# Altium schematic sheet Sheet1.SchDoc
size A2; SheetNumber: 1; SheetTotal: 1
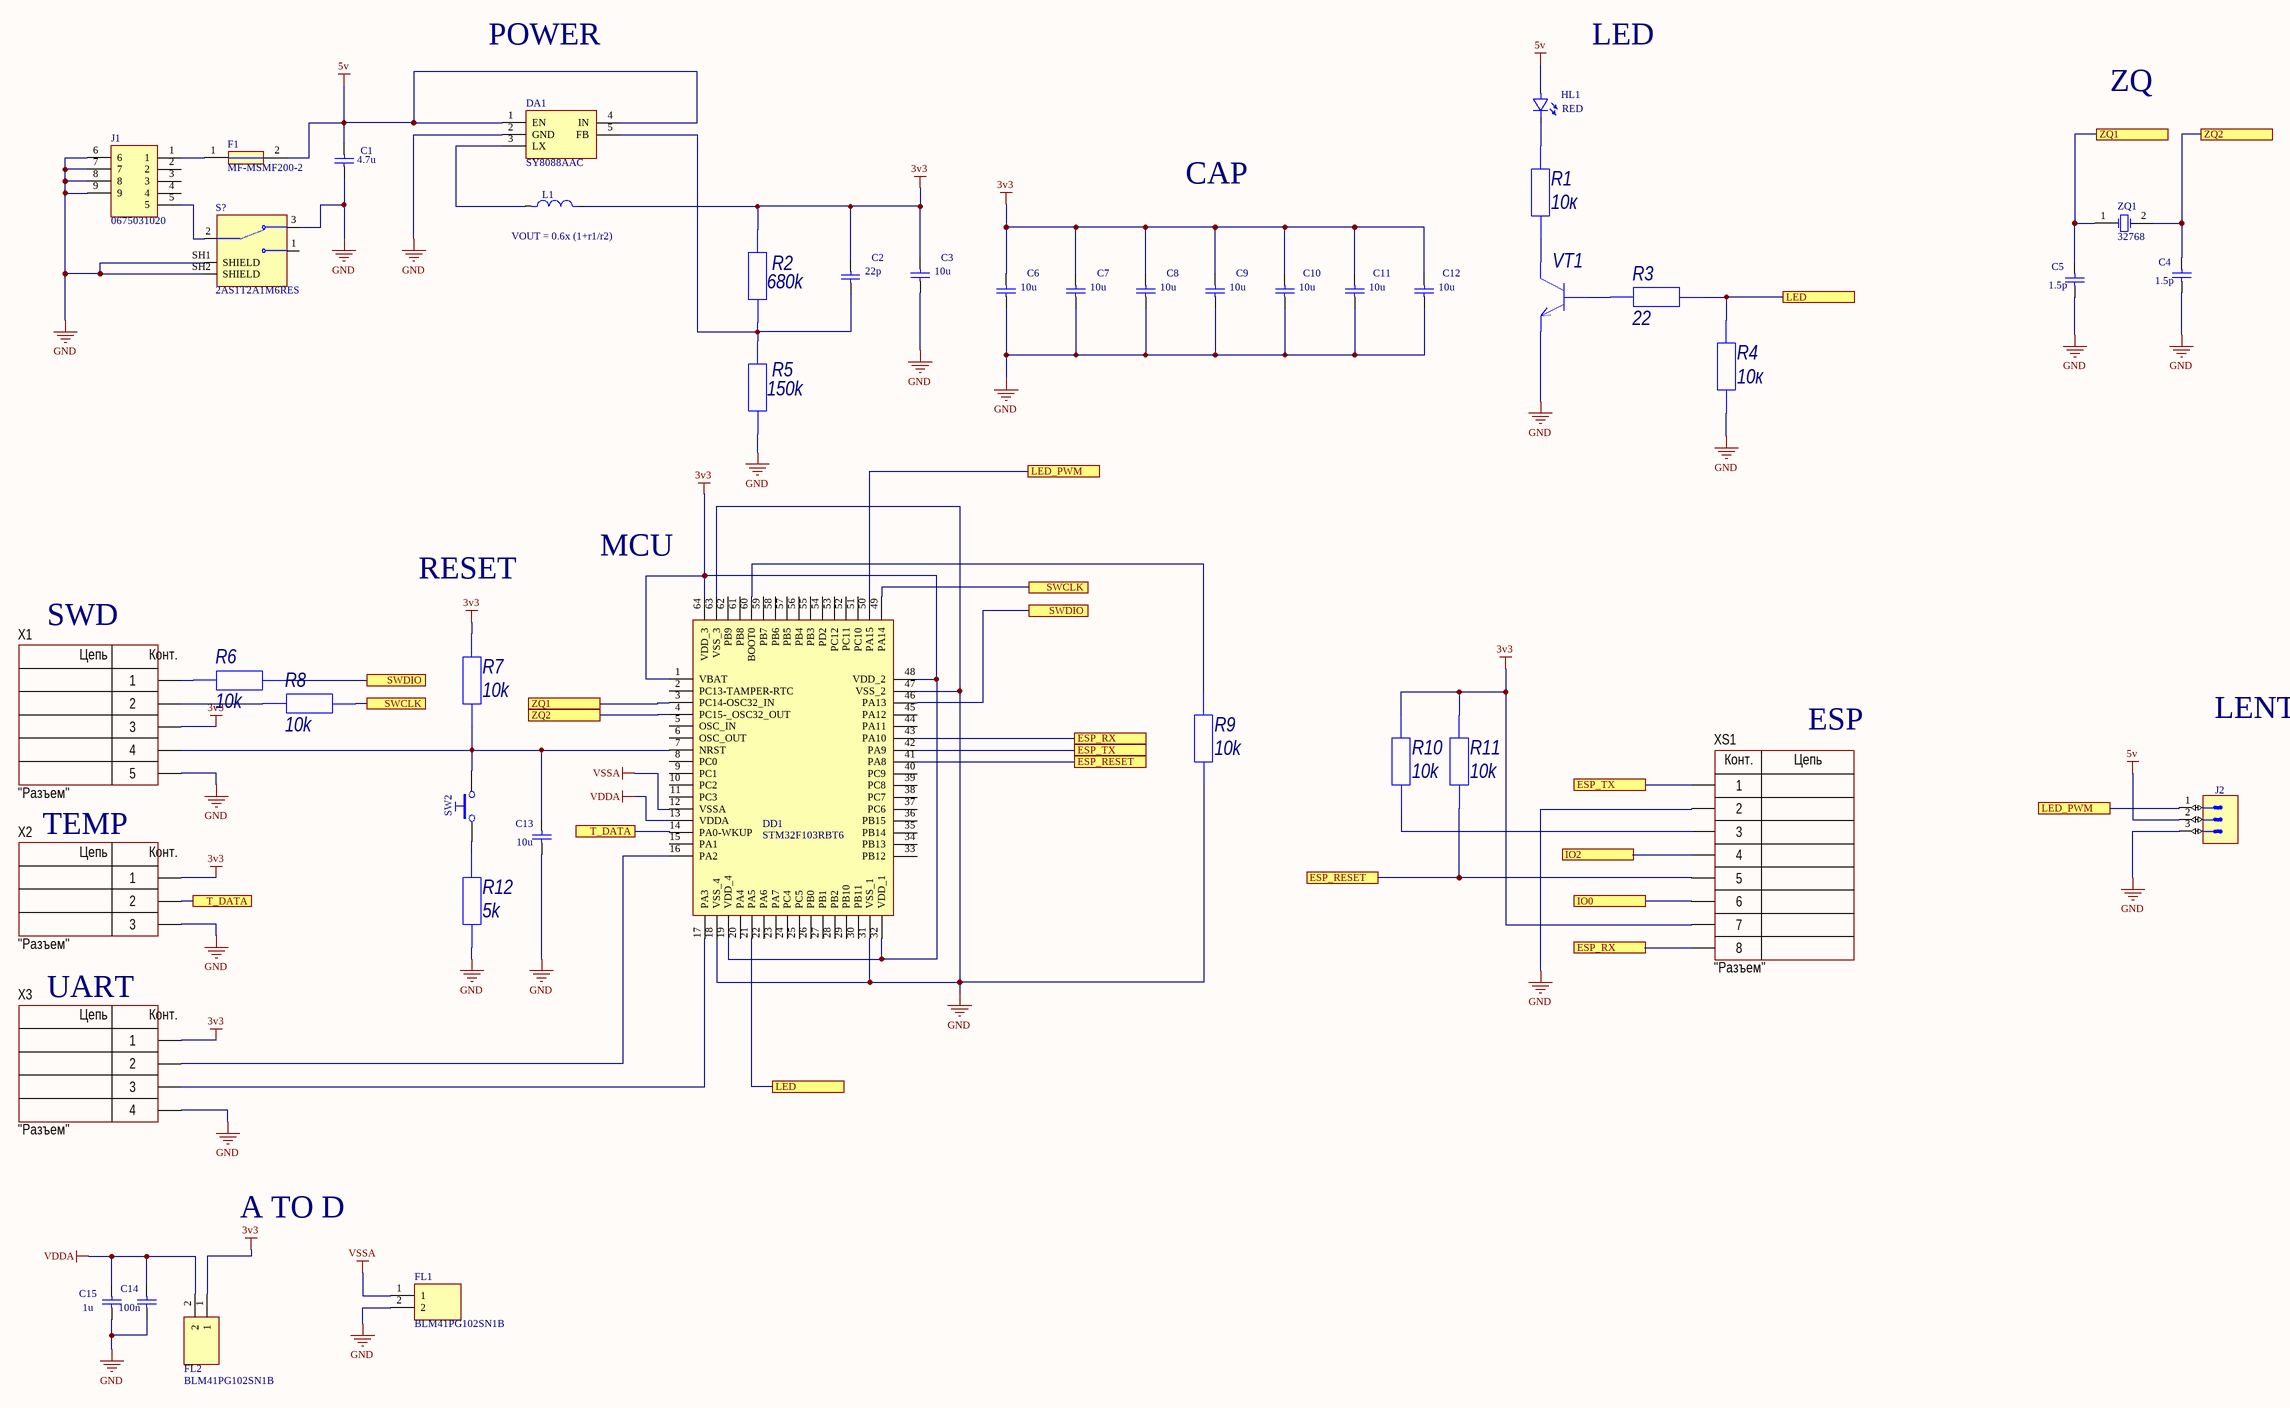
[diagram p0: Sheet1.SchDoc]

## Parts
C1  4.7u  [CAPC2012X135N]
C2  22p  [CAPC2012X135N]
C3  10u  [CAPC2012X135N]
C4  1.5p  [CAPC2012X135N]
C5  1.5p  [CAPC2012X135N]
C6  10u  [CAPC2012X135N]
C7  10u  [CAPC2012X135N]
C8  10u  [CAPC2012X135N]
C9  10u  [CAPC2012X135N]
C10  10u  [CAPC2012X135N]
C11  10u  [CAPC2012X135N]
C12  10u  [CAPC2012X135N]
C13  10u  [CAPC2012X135N]
C14  100n  [CAPC2012X135N]
C15  1u  [CAPC2012X135N]
DA1  SY8088AAC  [SOT95P285X140-5N]
DD1  STM32F103RBT6  [QFP50P1200X1200X160-64N]
F1  MF-MSMF200-2  [FUSC4632X85N]
FL1  BLM41PG102SN1B  [BLM41PG102SH1L]
FL2  BLM41PG102SN1B  [BLM41PG102SH1L]
HL1  RED  [LED_OSRAM_LGN971]
J1  0675031020  [0675031020]
J2  KK®  [MOLEX_22-27-2031]  (value not drawn)
L1  5.6nH  [INDM3225X240N]  (value not drawn)
R1  10к  [R0805]
R2  680k  [R0805]
R3  22  [R0805]
R4  10к  [R0805]
R5  150k  [R0805]
R6  10k  [R0805]
R7  10k  [R0805]
R8  10k  [R0805]
R9  10k  [R0805]
R10  10k  [R0805]
R11  10k  [R0805]
R12  5k  [R0805]
S?  2AS1T2A1M6RES  [SW_2AS1T2A1M6RES]
SW2  Push Button  [TS-Axx-BTN]  (value not drawn)
VT1  BJT-NPN  [SOT-23]  (value not drawn)
X1  CommentText: "Разъем"  [CON: PLS-5]
X2  CommentText: "Разъем"  [CON: PLS-3]
X3  CommentText: "Разъем"  [CON: PLS-4]
XS1  CommentText: "Разъем"  [CON: PBD-8]
ZQ1  32768  [RESC3216X65N]

## Ports
ESP_RESET, ESP_RX, ESP_TX, IO0, IO2, LED, LED_PWM, SWCLK, SWDIO, T_DATA, ZQ1, ZQ2

## Nets
3v3: C2.2 C3.2 C6.2 C7.2 C8.2 C9.2 C10.2 C11.2 C12.2 DD1.1(VBAT) DD1.19(VDD_4) DD1.32(VDD_1) DD1.48(VDD_2) DD1.64(VDD_3) FL2.1 L1.2 R2.1 R7.2 R10.2 R11.2 X1.3 X2.1 X3.1 XS1.7
5v: C1.2 DA1.1(EN) DA1.4(IN) F1.2 HL1.2(A) J2.2
GND: C1.1 C3.1 C4.1 C5.1 C6.1 C7.1 C8.1 C9.1 C10.1 C11.1 C12.1 C13.1 C14.1 C15.1 DA1.2(GND) DD1.18(VSS_4) DD1.31(VSS_1) DD1.47(VSS_2) DD1.63(VSS_3) FL1.2 J1.6 J1.7 J1.8 J1.9 J2.3 R4.2 R5.2 R9.1 R12.1 S?.3(NC) S?.SH1(SHIELD) S?.SH2(SHIELD) VT1.3(Э) X1.5 X2.3 X3.4 XS1.2
VDDA: C14.2 C15.2 DD1.13(VDDA) FL2.2
VSSA: DD1.12(VSSA) FL1.1
ESP_RESET: DD1.41(PA8) R11.1 XS1.5 ; port ESP_RESET
ESP_RX: DD1.43(PA10) XS1.8 ; port ESP_RX
ESP_TX: DD1.42(PA9) XS1.1 ; port ESP_TX
IO0: XS1.6 ; port IO0
IO2: XS1.4 ; port IO2
LED: DD1.21(PA5) R3.1 R4.1 ; port LED
LED_PWM: DD1.50(PA15) J2.1 ; port LED_PWM
SWCLK: DD1.49(PA14) R8.1 ; port SWCLK
SWDIO: DD1.46(PA13) R6.1 ; port SWDIO
T_DATA: DD1.14(PA0-WKUP) X2.2 ; port T_DATA
ZQ1: C5.2 DD1.3(PC14-OSC32_IN) ZQ1.1(OSC1) ; port ZQ1
ZQ2: C4.2 DD1.4(PC15-_OSC32_OUT) ZQ1.2(OSC2) ; port ZQ2
NetC2_1: C2.1 DA1.5(FB) R2.2 R5.1
NetC13_2: C13.2 DD1.7(NRST) R7.1 SW2.2 X1.4
NetDA1_3: DA1.3(LX) L1.1
NetDD1_16: DD1.16(PA2) X3.2
NetDD1_17: DD1.17(PA3) X3.3
NetDD1_60: DD1.60(BOOT0) R9.2
NetF1_1: F1.1 J1.1
NetHL1_1: HL1.1(C) R1.1
NetJ1_5: J1.5 S?.2(COMM)
NetR1_2: R1.2 VT1.2(К)
NetR3_2: R3.2 VT1.1(Б)
NetR6_2: R6.2 X1.1
NetR8_2: R8.2 X1.2
NetR10_1: R10.1 XS1.3
NetR12_2: R12.2 SW2.1

Not connected (* = marked no-connect by the designer): DD1 2(PC13-TAMPER-RTC) 5(OSC_IN) 6(OSC_OUT) 8(PC0) 9(PC1) 10(PC2) 11(PC3) 15(PA1) 20(PA4) 22(PA6) 23(PA7) 24(PC4) 25(PC5) 26(PB0) 27(PB1) 28(PB2) 29(PB10) 30(PB11) 33(PB12) 34(PB13) 35(PB14) 36(PB15) 37(PC6) 38(PC7) 39(PC8) 40(PC9) 44(PA11) 45(PA12) 51(PC10) 52(PC11) 53(PC12) 54(PD2) 55(PB3) 56(PB4) 57(PB5) 58(PB6) 59(PB7) 61(PB8) 62(PB9); J1 2 3 4; S? 1(NO)

## Notes on the sheet
- POWER
- LED
- ZQ
- CAP
- (near L1) VOUT = 0.6x (1+r1/r2)
- MCU
- RESET
- SWD
- ESP
- LENTA
- TEMP
- UART
- A TO D
- (in symbol PBD-8) Конт.; Цепь
- (in symbol PLS-3) Цепь; Конт.
- (in symbol PLS-4) Цепь; Конт.
- (in symbol PLS-5) Цепь; Конт.

## Library data of the parts
C1-C15 = CC0805_1NF_50V_5%_NP0: Non-polarised capacitor; Part Description: SMD Multilayer Chip Ceramic Capacitor; Manufacturer: GENERIC; Manufacturer1 Part Number: C0805C102J5GACTU; Value: 1n; Voltage: 50V; TC: NP0; Tolerance: ±5%; Part Number: CC0805_1NF_50V_5%_NP0; Component Kind: Standard; Component Type: Standard; Pin Count: 2; Status: None; Manufacturer Part Number: CC0805_1NF_50V_5%_NP0; Case: 0805; Mounted: Yes; Socket: No; SMD: Yes; Manufacturer1 Example: KEMET; Manufacturer1 ComponentHeight: 0.88mm; HelpURL: \\cern.ch\dfs\Applications\Altium\Datasheets\CC0805_NP0_KEMET.pdf; Author: CERN DEM JLC; CreateDate: 02.02.2011; LatestRevisionDate: 02.02.2011
DA1 = SY8088AAC: Power Supply; Manufacturer_Name: Silergy Corp; Datasheet Link: https://datasheet.lcsc.com/szlcsc/Silergy-Corp-SY8088AAC_C79313.pdf; Height: 1.4mm; Manufacturer_Part_Number: SY8088AAC
DD1 = STM32F103RBT6: Integrated Circuit; Manufacturer_Name: STMicroelectronics; Datasheet Link: http://www.st.com/st-web-ui/static/active/en/resource/technical/document/datasheet/CD00161566.pdf; Height: 1.6mm; Manufacturer_Part_Number: STM32F103RBT6; Mouser Part Number: 511-STM32F103RBT6; Mouser Price/Stock: https://www.mouser.co.uk/ProductDetail/STMicroelectronics/STM32F103RBT6?qs=bhCVus9SdFv12dJRZaBmJg%3D%3D; Arrow Part Number: STM32F103RBT6; Arrow Price/Stock: https://www.arrow.com/en/products/stm32f103rbt6/stmicroelectronics?region=europe
F1 = MF-MSMF200-2: Fuse; Manufacturer_Name: Bourns; Datasheet Link: http://uk.rs-online.com/web/p/products/6478263; Height: 0.85mm; Manufacturer_Part_Number: MF-MSMF200-2; Mouser Part Number: 652-MF-MSMF200-2; Mouser Price/Stock: https://www.mouser.co.uk/ProductDetail/Bourns/MF-MSMF200-2?qs=UBppDQZA%252BGTG9DpaUCFm8g%3D%3D; Arrow Part Number: MF-MSMF200-2; Arrow Price/Stock: https://www.arrow.com/en/products/mf-msmf200-2/bourns?region=nac
FL1 FL2 = BLM41PG102SN1B: Filter; Manufacturer_Name: Murata Electronics; Datasheet Link: https://www.murata.com/en-us/products/productdetail?partno=BLM41PG102SN1%23; Height: 1.8mm; Manufacturer_Part_Number: BLM41PG102SN1B; Mouser Part Number: 81-BLM41PG102SN1B; Mouser Price/Stock: https://www.mouser.co.uk/ProductDetail/Murata-Electronics/BLM41PG102SN1B?qs=%2F%252BYoplLUB5gO4z9jcqAVCQ%3D%3D; Arrow Part Number: BLM41PG102SN1B; Arrow Price/Stock: https://www.arrow.com/en/products/blm41pg102sn1b/murata-manufacturing
HL1 = LED_OSRAM_LGN971: LED 1C 2A; Part Description: Surface Mount Green LED (1206 Case); Manufacturer: OSRAM; Manufacturer Part Number: LGN971; Color: Green; Part Number: LED_OSRAM_LGN971; Component Kind: Standard; Component Type: Standard; PackageDescription: Green Chip LED, 2-Leads, Body 3.2 x1.6mm, IPC Medium Density; Pin Count: 2; Case: 1206; Mounted: Yes; Socket: No; SMD: Yes; ComponentHeight: 1.2mm; HelpURL: \\cern.ch\dfs\Applications\Altium\Datasheets\LED_OSRAM_LGN971.pdf; Author: CERN DEM JLC; CreateDate: 15.09.2009; LatestRevisionDate: 17.03.2010
J1 = 0675031020: Connector; Manufacturer_Name: Molex; Datasheet Link: http://www.molex.com/webdocs/datasheets/pdf/en-us/0675031020_IO_CONNECTORS.pdf; Manufacturer_Part_Number: 0675031020; Mouser Part Number: N/A; Mouser Price/Stock: https://www.mouser.co.uk/ProductDetail/Molex/0675031020?qs=PBcRNPEHKsqIYt%2F7ECA4dQ%3D%3D; Arrow Part Number: 0675031020; Arrow Price/Stock: https://www.arrow.com/en/products/0675031020/molex?region=europe
J2 = MOLEX_22-27-2031: Connector 3 Male; Part Description: 2.54mm (.100") Pitch KK® Wire-to-Board Header, Vertical, with Friction Lock, 3 Circuits, Tin (Sn) Plating; Manufacturer: MOLEX; Part Number: MOLEX_22-27-2031; Component Kind: Standard; Component Type: Standard; Pin Count: 3; Family: KK®; Mounted: Yes; Socket: No; SMD: No; Status: None; Manufacturer Part Number: 22-27-2031; ComponentHeight: 11.7mm; HelpURL: \\cern.ch\dfs\Applications\Altium\Datasheets\MOLEX_22-27-2031.pdf; Author: CERN DEM JLC; CreateDate: 04.12.2008; LatestRevisionDate: 04.12.2008
L1 = IND1210_5.6NH_5%_TDK_NLV32T: Inductor; Part Description: SMT Inductors (Coil) For Signal Line(Wound); Manufacturer: TDK; Manufacturer Part Number: NLV32T-056J-PF; Power: 450mA; Resistance: 0.33R; Tolerance: ±5%; Part Number: IND1210_5.6NH_5%_TDK_NLV32T; Component Kind: Standard; Component Type: Standard; Pin Count: 2; Value: 5.6nH; Status: None; Case: 1210; Mounted: Yes; Socket: No; SMD: Yes; ComponentHeight: 2.4mm; HelpURL: \\cern.ch\dfs\Applications\Altium\Datasheets\IND1210_TDK_NLV32T.pdf; Author: CERN DEM JLC; CreateDate: 20.04.2010; LatestRevisionDate: 20.04.2010
R1 R2 R4-R12 = Р1-12-0,125-22 Ом±5%-М: Manufacturer: ОАО "Ресурс"; ID: 11; Value: 22; Limit Voltage: 150V; Tolerance: ±5%; Temperature Coefficient: 250ppm; Total Power Dissipation: 0,125W; Specification: ШКАБ.434110.002 ТУ; Application Category: 5; Working Temperature Min: -60°С; Working Temperature Max: +85°С; Published: 24.03.2010; Publisher: Andrew Danich; Type: Резистор; Part Number: Р1-12-0,125-22 Ом±5%-М; Footprint: 0805
R3 = Р1-12-0,125-22 Ом±5%-М: Manufacturer: ОАО "Ресурс"; ID: 11; Limit Voltage: 150V; Tolerance: ±5%; Temperature Coefficient: 250ppm; Total Power Dissipation: 0,125W; Specification: ШКАБ.434110.002 ТУ; Application Category: 5; Working Temperature Min: -60°С; Working Temperature Max: +85°С; Published: 24.03.2010; Publisher: Andrew Danich; Type: Резистор; Part Number: Р1-12-0,125-22 Ом±5%-М; Value: 22; Footprint: 0805
S? = 2AS1T2A1M6RES: Toggle Switches Sealed Sub-Miniature SPDT switch on-on right angle pc thru-hole; MF: Dailywell; Package: None; Price: None; Value: *; SnapEDA_Link: https://www.snapeda.com/parts/2AS1T2A1M6RES/Dailywell/view-part/?ref=snap; MP: 2AS1T2A1M6RES; Availability: In Stock; Check_prices: https://www.snapeda.com/parts/2AS1T2A1M6RES/Dailywell/view-part/?ref=eda
SW2 = PB_TYCO_ALCOSWITCH_FSMSM: Push-Button Switch SPDT; Part Description: 12VDC 50mA SPST Tactile  Push-Button Switch; Manufacturer: TYCO ALCOSWITCH; Manufacturer Part Number: FSMSM or 1437566-3; Part Number: PB_TYCO_ALCOSWITCH_FSMSM; Component Kind: Standard; Component Type: Standard; Footprint: PB_TYCO_ALCOSWITCH_FSMSM; Pin Count: 2; PackageDescription: Body 3.5x6.0mm, Pushbutton Switch,  TYCO ALCOSWITCH FSMSM Serie; Family: Push Button; Mounted: Yes; Socket: No; SMD: Yes; Status: None; ComponentHeight: 4.3mm; HelpURL: \\cern.ch\dfs\Applications\Altium\Datasheets\PB_TYCO_ALCOSWITCH_FSMSM.pdf; Author: CERN DEM JLC; CreateDate: 30.06.2008; LatestRevisionDate: 08.09.2008
VT1 = 2Т3130А9: Manufacturer: ООО "НПК "ДАЛЕКС"; Type: Транзистор; ID: 1; C-E Voltage: 40V; Collector Current: 100mA; DC Current Gain: 80; Specification: аАО.339.569 ТУ; Application Category: 5; Working Temperature Min: -60°С; Working Temperature Max: +85°С; Functional Analog: BC847A, BC846A; Published: 07.05.2013; Publisher: Andrew Danich; Part Number: 2Т3130А9; Value: 2Т3130А9
X1 = PLS-5: Manufacturer: Connfly; ValueManufacturerPartNumber: Connector, 5pin, 2.54mm, 500VAC, 3A; TypeConnector: Connector; VoltageMax: 500VAC; Pitch: 2.54mm; CurrentMax: 3A; Multichannel: 5pin; HelpURL: https://www.chipdip.ru/product/pls-5; PartNumber: PLS-5
X2 = PLS-3: Manufacturer: Connfly; ValueManufacturerPartNumber: Connector, 3pin, 2.54mm, 500VAC, 3A; TypeConnector: Connector; VoltageMax: 500VAC; Pitch: 2.54mm; CurrentMax: 3A; Multichannel: 3pin; HelpURL: https://www.chipdip.ru/product/pls-3; PartNumber: PLS-3
X3 = PLS-4: Manufacturer: Connfly; ValueManufacturerPartNumber: Connector, 4pin, 2.54mm, 500VAC, 3A; TypeConnector: Connector; VoltageMax: 500VAC; Pitch: 2.54mm; CurrentMax: 3A; Multichannel: 4pin; HelpURL: https://www.chipdip.ru/product/pls-4; PartNumber: PLS-4
XS1 = PBD-8: Manufacturer: Connfly; ValueManufacturerPartNumber: Connector, 8pin, 2.54mm, 500VAC, 3A; TypeConnector: Connector; VoltageMax: 500VAC; Pitch: 2.54mm; CurrentMax: 3A; Multichannel: 8pin; HelpURL: https://www.chipdip.ru/product/pbd-8; PartNumber: PBD-8
ZQ1 = XTAL: Crystal Oscillator; Published: 8-Jun-2000; LatestRevisionDate: 17-Jul-2002; LatestRevisionNote: Re-released for DXP Platform.; PackageReference: R38; Publisher: Altium Limited; PackageDescription: Crystal, Thru-Hole; 2 Leads; Body 3.1 x 8.2 mm (Dia.xH)